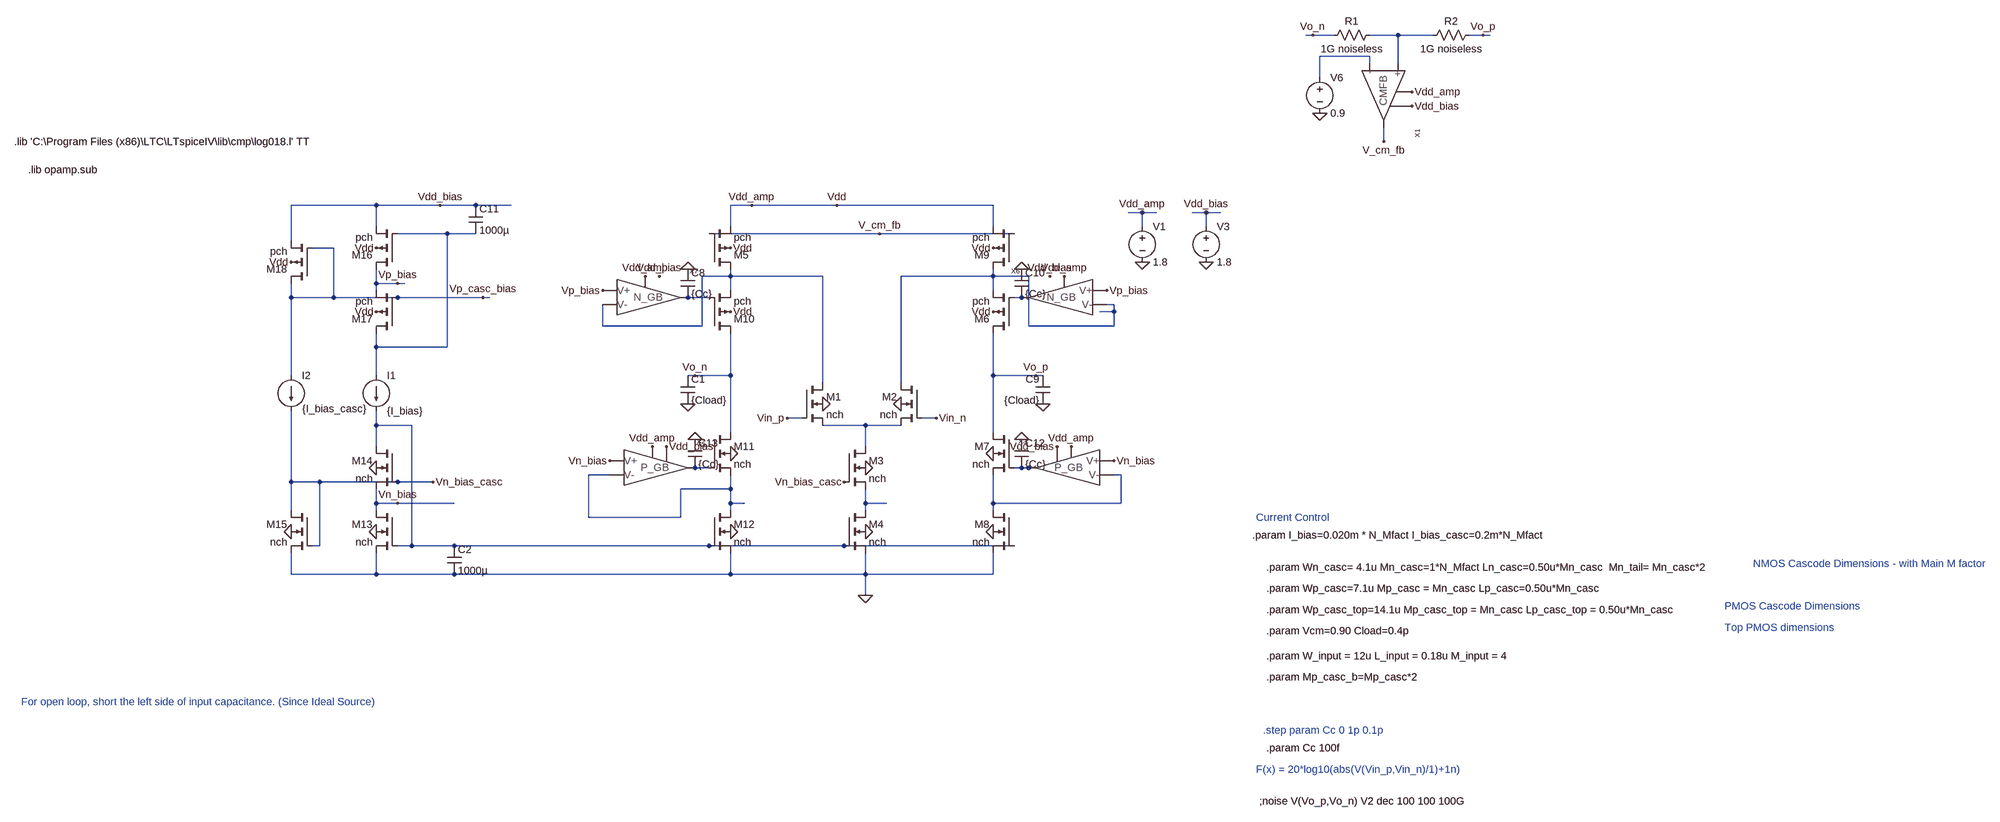
[diagram p0: schematic Discrete_Amplifier_1X Test_platform.asc]
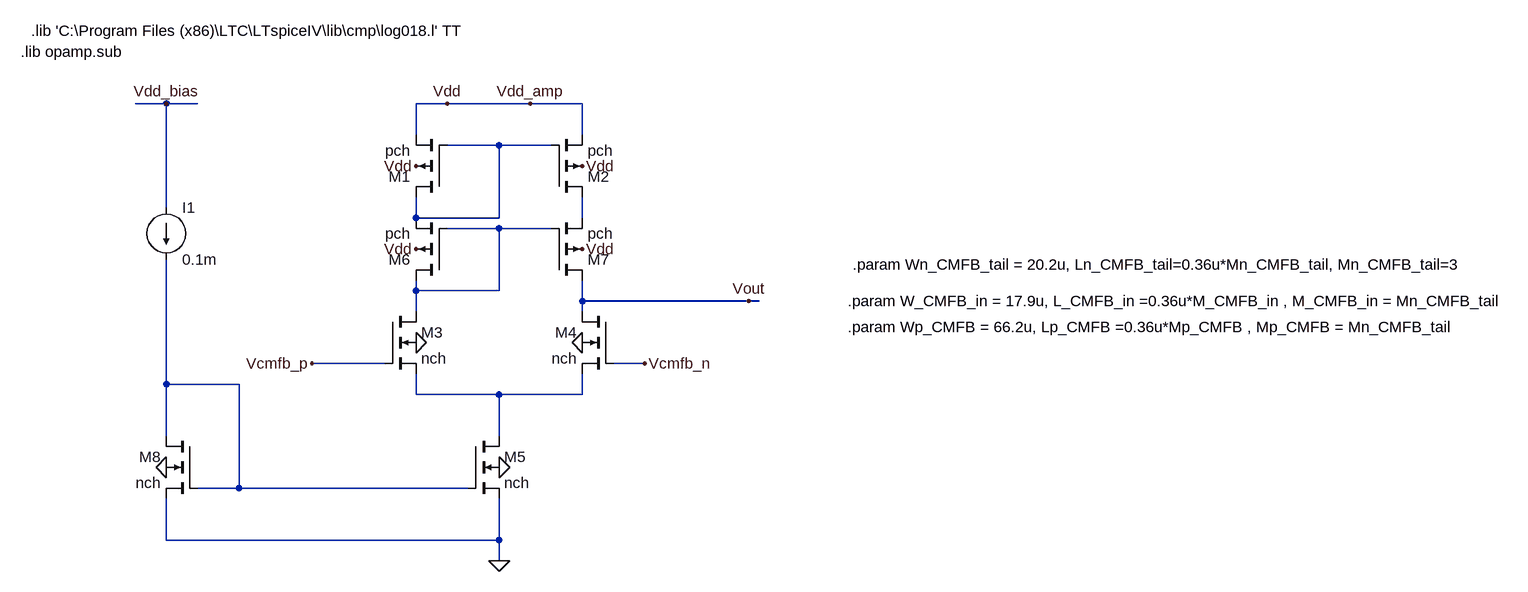
[diagram p1: sub-circuit cmfb_amplifier_comp_model.asc]
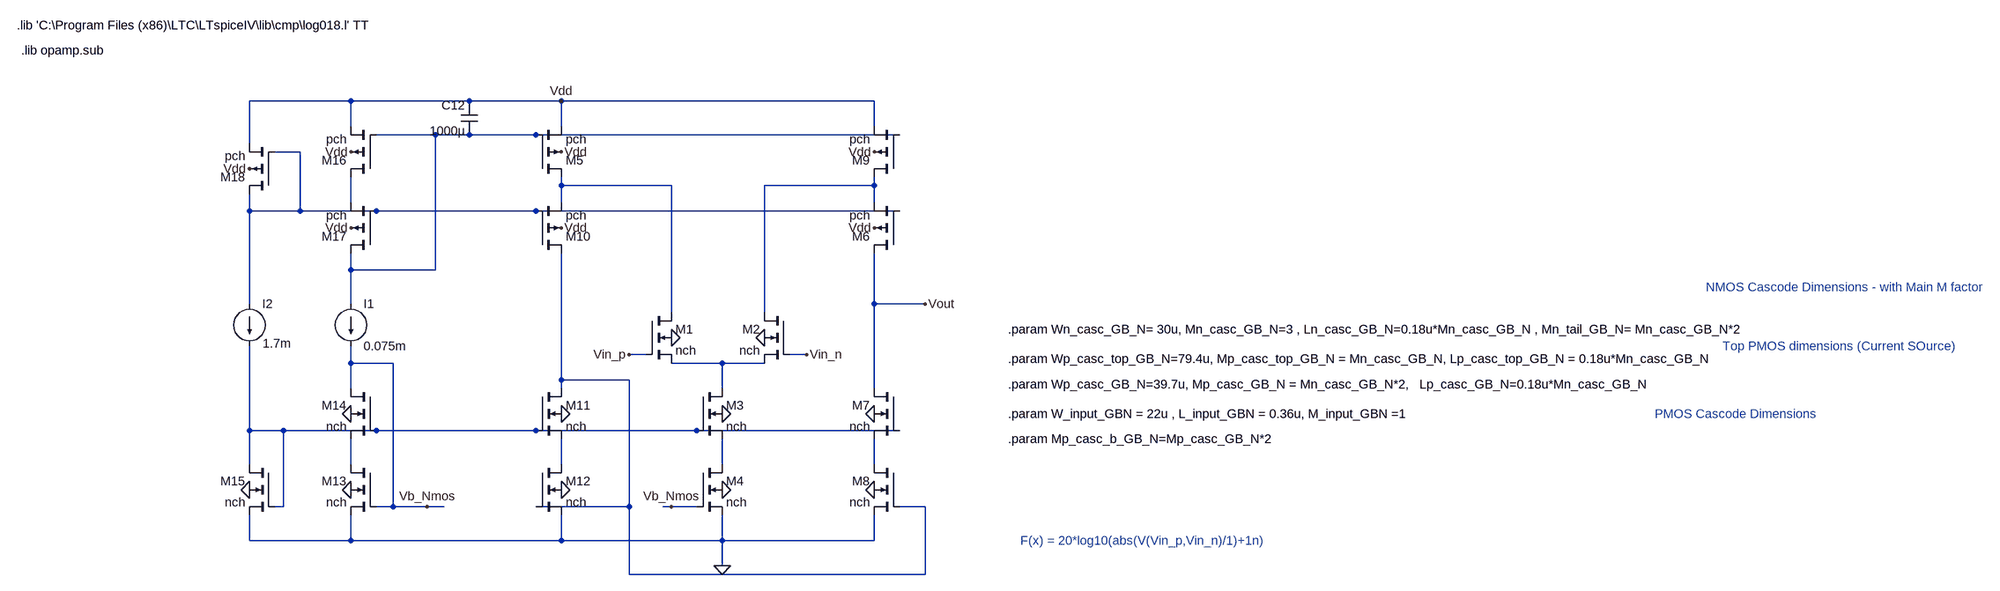
[diagram p2: sub-circuit gb-nmos.asc]
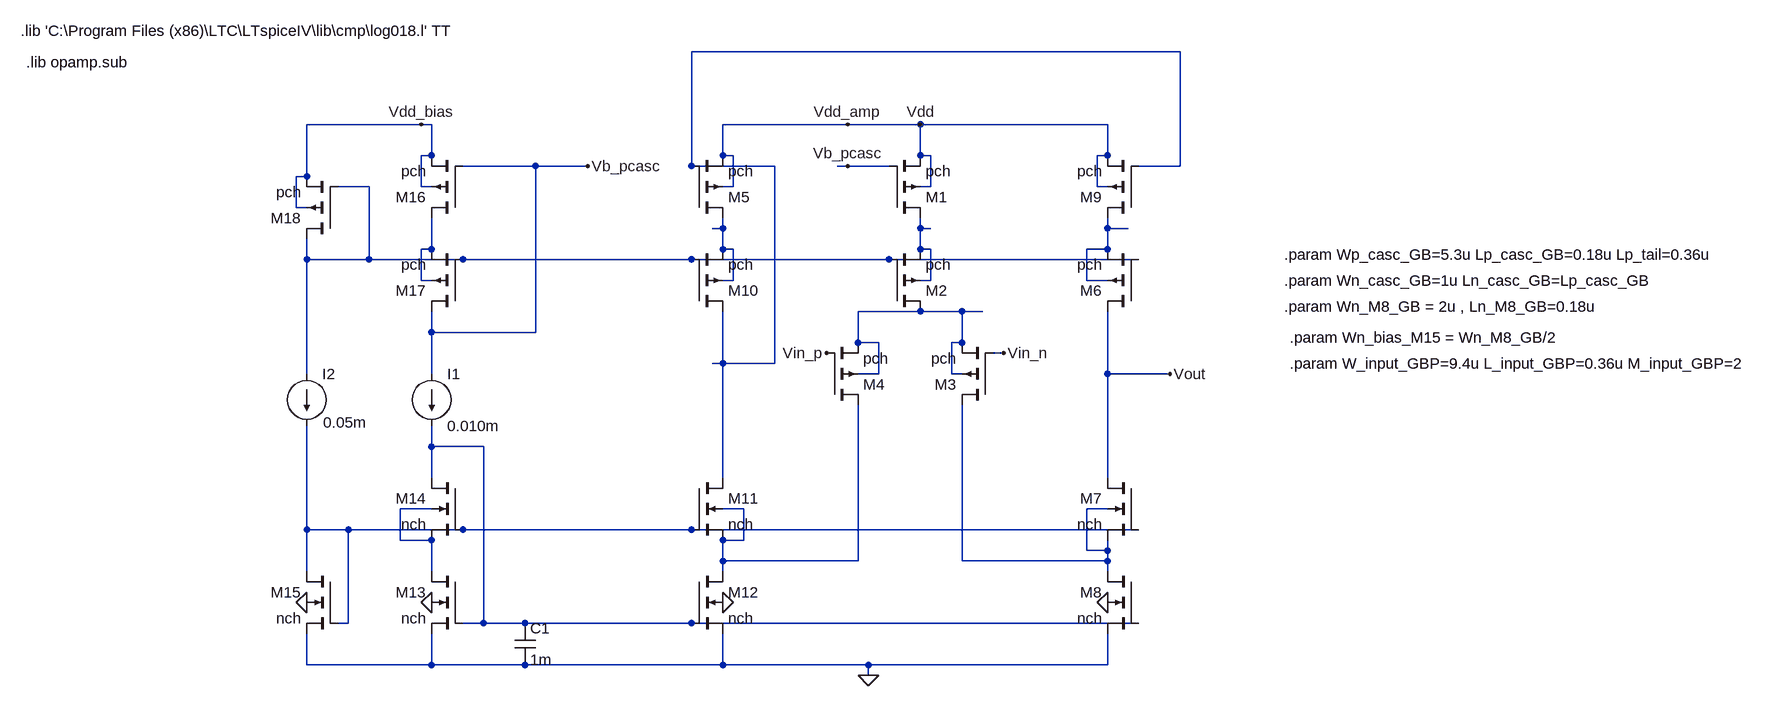
[diagram p3: sub-circuit gb-pmos.asc]
Discrete_Amplifier_1X Test_platform.asc, the LTspice schematic file:
Version 4
SHEET 1 5520 2052
WIRE 2368 -1264 2352 -1264
WIRE 2416 -1264 2368 -1264
WIRE 2560 -1264 2496 -1264
WIRE 2640 -1264 2560 -1264
WIRE 2752 -1264 2720 -1264
WIRE 2768 -1264 2752 -1264
WIRE 2496 -1216 2384 -1216
WIRE 2496 -1200 2496 -1216
WIRE 2560 -1200 2560 -1264
WIRE 2384 -1168 2384 -1216
WIRE 2528 -1024 2528 -1056
WIRE 208 -880 16 -880
WIRE 352 -880 208 -880
WIRE 432 -880 352 -880
WIRE 512 -880 432 -880
WIRE 1104 -880 1056 -880
WIRE 1296 -880 1104 -880
WIRE 1648 -880 1296 -880
WIRE 1984 -864 1952 -864
WIRE 2016 -864 1984 -864
WIRE 2128 -864 2096 -864
WIRE 2160 -864 2128 -864
WIRE 208 -832 208 -880
WIRE 1056 -832 1056 -880
WIRE 1648 -832 1648 -880
WIRE 1984 -832 1984 -864
WIRE 2128 -832 2128 -864
WIRE 368 -816 256 -816
WIRE 432 -816 368 -816
WIRE 1392 -816 1008 -816
WIRE 1696 -816 1392 -816
WIRE 16 -800 16 -880
WIRE 112 -784 64 -784
WIRE 1056 -720 1056 -736
WIRE 1056 -720 992 -720
WIRE 1264 -720 1056 -720
WIRE 1648 -720 1648 -736
WIRE 1648 -720 1440 -720
WIRE 1728 -720 1648 -720
WIRE 208 -704 208 -736
WIRE 256 -704 208 -704
WIRE 272 -704 256 -704
WIRE 208 -688 208 -704
WIRE 1056 -688 1056 -720
WIRE 1648 -688 1648 -720
WIRE 16 -672 16 -704
WIRE 112 -672 112 -784
WIRE 112 -672 16 -672
WIRE 256 -672 112 -672
WIRE 448 -672 256 -672
WIRE 464 -672 448 -672
WIRE 1008 -672 960 -672
WIRE 1712 -672 1696 -672
WIRE 1920 -656 1904 -656
WIRE 1920 -640 1920 -656
WIRE 1920 -640 1888 -640
WIRE 768 -608 768 -656
WIRE 992 -608 992 -720
WIRE 992 -608 768 -608
WIRE 1728 -608 1728 -720
WIRE 1920 -608 1920 -640
WIRE 1920 -608 1728 -608
WIRE 208 -560 208 -592
WIRE 368 -560 368 -816
WIRE 368 -560 208 -560
WIRE 16 -496 16 -672
WIRE 208 -496 208 -560
WIRE 976 -496 960 -496
WIRE 1056 -496 1056 -592
WIRE 1056 -496 976 -496
WIRE 1648 -496 1648 -592
WIRE 1744 -496 1648 -496
WIRE 1760 -496 1744 -496
WIRE 1264 -480 1264 -720
WIRE 1440 -480 1440 -720
WIRE 1216 -400 1184 -400
WIRE 1520 -400 1488 -400
WIRE 208 -384 208 -416
WIRE 288 -384 208 -384
WIRE 1360 -384 1264 -384
WIRE 1440 -384 1360 -384
WIRE 1056 -368 1056 -496
WIRE 1648 -368 1648 -496
WIRE 208 -336 208 -384
WIRE 1360 -336 1360 -384
WIRE 976 -288 960 -288
WIRE 1008 -288 976 -288
WIRE 1712 -288 1696 -288
WIRE 1728 -288 1712 -288
WIRE 1744 -288 1728 -288
WIRE 784 -272 736 -272
WIRE 1936 -272 1920 -272
WIRE 16 -256 16 -416
WIRE 80 -256 16 -256
WIRE 256 -256 80 -256
WIRE 336 -256 256 -256
WIRE 1056 -240 1056 -272
WIRE 1056 -240 944 -240
WIRE 208 -208 208 -240
WIRE 256 -208 208 -208
WIRE 384 -208 256 -208
WIRE 1056 -208 1056 -240
WIRE 1088 -208 1056 -208
WIRE 1360 -208 1360 -240
WIRE 1408 -208 1360 -208
WIRE 1648 -208 1648 -272
WIRE 1936 -208 1936 -272
WIRE 1936 -208 1648 -208
WIRE 16 -192 16 -256
WIRE 208 -192 208 -208
WIRE 1056 -192 1056 -208
WIRE 1360 -192 1360 -208
WIRE 1648 -192 1648 -208
WIRE 736 -176 736 -272
WIRE 944 -176 944 -240
WIRE 944 -176 736 -176
WIRE 80 -112 80 -256
WIRE 80 -112 64 -112
WIRE 288 -112 288 -384
WIRE 288 -112 256 -112
WIRE 384 -112 288 -112
WIRE 1008 -112 384 -112
WIRE 1312 -112 1008 -112
WIRE 1696 -112 1312 -112
WIRE 16 -48 16 -96
WIRE 208 -48 208 -96
WIRE 208 -48 16 -48
WIRE 384 -48 208 -48
WIRE 1056 -48 1056 -96
WIRE 1056 -48 384 -48
WIRE 1360 -48 1360 -96
WIRE 1360 -48 1056 -48
WIRE 1648 -48 1648 -96
WIRE 1648 -48 1360 -48
WIRE 1360 0 1360 -48
FLAG 1264 -432 0
FLAG 1360 -288 0
FLAG 1360 -144 0
FLAG 1360 0 0
FLAG 1056 -320 0
FLAG 1056 -144 0
FLAG 1984 -752 0
FLAG 1984 -864 Vdd_amp
FLAG 1056 -640 Vdd
FLAG 1056 -784 Vdd
FLAG 208 -144 0
FLAG 16 -144 0
FLAG 208 -288 0
FLAG 208 -784 Vdd
FLAG 208 -640 Vdd
FLAG 16 -752 Vdd
FLAG 1440 -432 0
FLAG 1648 -320 0
FLAG 1648 -144 0
FLAG 352 -880 Vdd_bias
FLAG 1648 -640 Vdd
FLAG 1648 -784 Vdd
FLAG 1392 -816 V_cm_fb
FLAG 1184 -400 Vin_p
FLAG 1520 -400 Vin_n
FLAG 976 -496 Vo_n
FLAG 1744 -496 Vo_p
FLAG 2752 -1264 Vo_p
FLAG 2368 -1264 Vo_n
FLAG 960 -432 0
FLAG 256 -208 Vn_bias
FLAG 336 -256 Vn_bias_casc
FLAG 1312 -256 Vn_bias_casc
FLAG 256 -704 Vp_bias
FLAG 2528 -1024 V_cm_fb
FLAG 2128 -752 0
FLAG 2128 -864 Vdd_bias
FLAG 2592 -1104 Vdd_bias
FLAG 2592 -1136 Vdd_amp
FLAG 1104 -880 Vdd_amp
FLAG 2384 -1088 0
FLAG 1296 -880 Vdd
FLAG 1808 -720 Vdd_amp
FLAG 1776 -720 Vdd_bias
FLAG 1904 -688 Vp_bias
FLAG 448 -672 Vp_casc_bias
FLAG 768 -688 Vp_bias
FLAG 864 -720 Vdd_amp
FLAG 896 -720 Vdd_bias
FLAG 1760 -432 0
FLAG 912 -336 Vdd_bias
FLAG 880 -336 Vdd_amp
FLAG 1792 -336 Vdd_bias
FLAG 1824 -336 Vdd_amp
FLAG 1712 -352 0
FLAG 976 -352 0
FLAG 784 -304 Vn_bias
FLAG 1920 -304 Vn_bias
FLAG 960 -736 0
FLAG 1712 -736 0
DATAFLAG 1360 -384 "round($*10k)/10k"
DATAFLAG 1408 -208 "round($*10k)/10k"
DATAFLAG 1168 -720 "round($*100)/100"
DATAFLAG 1536 -720 "round($*100)/100"
DATAFLAG 1552 -880 "round($*1k)/1k"
DATAFLAG 1648 -560 "round($*1k)/1k"
DATAFLAG 1264 -608 "Id(M1)"
DATAFLAG 2544 -1264 ""
DATAFLAG 320 -816 "round($*100)/100"
DATAFLAG 320 -672 "round($*10k)/10k"
DATAFLAG 384 -112 "round($*10k)/10k"
DATAFLAG 1136 -832 "-Id(M5)"
DATAFLAG 1280 -208 "Id(M4)"
DATAFLAG 1280 -112 "round($*10k)/10k"
DATAFLAG 384 -208 "round($*10k)/10k"
DATAFLAG 208 -704 "round($*10k)/10k"
DATAFLAG 1440 -608 "Id(M1)"
DATAFLAG 1056 -560 "round($*1k)/1k"
DATAFLAG 1264 -816 ""
DATAFLAG 320 -256 "round($*10k)/10k"
DATAFLAG 1648 -208 "round($*10k)/10k"
DATAFLAG 1088 -208 "round($*10k)/10k"
DATAFLAG 992 -288 ""
SYMBOL nmos4 1216 -480 R0
SYMATTR InstName M1
SYMATTR Value nch
SYMATTR Value2 l={L_input} w={W_input} m={M_input}
SYMBOL nmos4 1312 -336 R0
SYMATTR InstName M3
SYMATTR Value nch
SYMATTR Value2 l={Ln_casc} w={Wn_casc} m={Mn_tail}
SYMBOL nmos4 1312 -192 R0
SYMATTR InstName M4
SYMATTR Value nch
SYMATTR Value2 l={Ln_casc} w={Wn_casc} m={Mn_tail}
SYMBOL pmos4 1008 -592 M180
SYMATTR InstName M10
SYMATTR Value pch
SYMATTR Value2 l={Lp_casc} w={Wp_casc} m={Mp_casc}
SYMBOL nmos4 1008 -368 R0
SYMATTR InstName M11
SYMATTR Value nch
SYMATTR Value2 l={Ln_casc} w={Wn_casc} m={Mn_casc}
SYMBOL nmos4 1008 -192 R0
SYMATTR InstName M12
SYMATTR Value nch
SYMATTR Value2 l={Ln_casc} w={Wn_casc} m={Mn_casc}
SYMBOL voltage 1984 -848 R0
WINDOW 123 0 0 Left 2
WINDOW 39 0 0 Left 2
SYMATTR InstName V1
SYMATTR Value 1.8
SYMBOL pmos4 1008 -736 M180
SYMATTR InstName M5
SYMATTR Value pch
SYMATTR Value2 l={Lp_casc_top} w={Wp_casc_top} m={Mp_casc_top}
SYMBOL res 2512 -1280 R90
WINDOW 0 0 56 VBottom 2
WINDOW 3 32 56 VTop 2
SYMATTR InstName R1
SYMATTR Value 1G noiseless
SYMBOL res 2736 -1280 R90
WINDOW 0 0 56 VBottom 2
WINDOW 3 32 56 VTop 2
SYMATTR InstName R2
SYMATTR Value 1G noiseless
SYMBOL nmos4 256 -192 M0
SYMATTR InstName M13
SYMATTR Value nch
SYMATTR Value2 l={Ln_casc} w={Wn_casc} m={Mn_tail}
SYMBOL current 208 -496 R0
WINDOW 123 0 0 Left 2
WINDOW 39 0 0 Left 2
SYMATTR InstName I1
SYMATTR Value {I_bias}
SYMBOL nmos4 256 -336 M0
SYMATTR InstName M14
SYMATTR Value nch
SYMATTR Value2 l={Ln_casc} w={Wn_casc} m={Mn_tail}
SYMBOL current 16 -496 R0
WINDOW 123 0 0 Left 2
WINDOW 39 0 0 Left 2
WINDOW 3 25 75 Left 2
SYMATTR Value {I_bias_casc}
SYMATTR InstName I2
SYMBOL nmos4 64 -192 M0
SYMATTR InstName M15
SYMATTR Value nch
SYMATTR Value2 l={Ln_casc} w={Wn_casc} m={Mn_tail}
SYMBOL pmos4 256 -736 R180
SYMATTR InstName M16
SYMATTR Value pch
SYMATTR Value2 l={Lp_casc_top} w={Wp_casc_top} m={Mp_casc_top}
SYMBOL pmos4 256 -592 R180
SYMATTR InstName M17
SYMATTR Value pch
SYMATTR Value2 l={Lp_casc} w={Wp_casc} m={Mp_casc}
SYMBOL pmos4 64 -704 R180
SYMATTR InstName M18
SYMATTR Value pch
SYMATTR Value2 l={Lp_casc} w={Wp_casc} m={Mp_casc_b}
SYMBOL nmos4 1488 -480 M0
SYMATTR InstName M2
SYMATTR Value nch
SYMATTR Value2 l={L_input} w={W_input} m={M_input}
SYMBOL pmos4 1696 -592 R180
SYMATTR InstName M6
SYMATTR Value pch
SYMATTR Value2 l={Lp_casc} w={Wp_casc} m={Mp_casc}
SYMBOL nmos4 1696 -368 M0
SYMATTR InstName M7
SYMATTR Value nch
SYMATTR Value2 l={Ln_casc} w={Wn_Casc} m={Mn_casc}
SYMBOL nmos4 1696 -192 M0
SYMATTR InstName M8
SYMATTR Value nch
SYMATTR Value2 l={Ln_casc} w={Wn_Casc} m={Mn_casc}
SYMBOL pmos4 1696 -736 R180
SYMATTR InstName M9
SYMATTR Value pch
SYMATTR Value2 l={Lp_casc_top} w={Wp_casc_top} m={Mp_casc_top}
SYMBOL cap 368 -112 R0
SYMATTR InstName C2
SYMATTR Value 1000µ
SYMBOL cap 944 -496 R0
SYMATTR InstName C1
SYMATTR Value {Cload}
SYMBOL cap 1776 -496 M0
SYMATTR InstName C9
SYMATTR Value {Cload}
SYMBOL cap 416 -880 R0
SYMATTR InstName C11
SYMATTR Value 1000µ
SYMBOL CMFB_Amplifier_comp_model 2528 -1136 R90
SYMATTR InstName X1
SYMBOL voltage 2128 -848 R0
WINDOW 123 0 0 Left 2
WINDOW 39 0 0 Left 2
SYMATTR InstName V3
SYMATTR Value 1.8
SYMBOL voltage 2384 -1184 R0
WINDOW 123 0 0 Left 2
WINDOW 39 0 0 Left 2
SYMATTR InstName V6
SYMATTR Value 0.9
SYMBOL GB-NMOS 1808 -672 M0
SYMATTR InstName X6
SYMBOL GB-NMOS 864 -672 R0
SYMATTR InstName X7
SYMBOL GB-PMOS 880 -288 R0
SYMATTR InstName X2
SYMBOL GB-PMOS 1824 -288 M0
SYMATTR InstName X3
SYMBOL cap 1696 -352 R0
SYMATTR InstName C12
SYMATTR Value {Cc}
SYMBOL cap 960 -352 R0
SYMATTR InstName C13
SYMATTR Value {Cc}
SYMBOL cap 944 -736 R0
SYMATTR InstName C8
SYMATTR Value {Cc}
SYMBOL cap 1696 -736 R0
SYMATTR InstName C10
SYMATTR Value {Cc}
TEXT -608 -1024 Left 2 !.lib 'C:\\Program Files (x86)\\LTC\\LTspiceIV\\lib\\cmp\\log018.l' TT
TEXT -576 -960 Left 2 !.lib opamp.sub
TEXT 2264 -64 Left 2 !.param Wn_casc= 4.1u Mn_casc=1*N_Mfact Ln_casc=0.50u*Mn_casc  Mn_tail= Mn_casc*2
TEXT 2264 -16 Left 2 !.param Wp_casc=7.1u Mp_casc = Mn_casc Lp_casc=0.50u*Mn_casc
TEXT 2264 32 Left 2 !.param Wp_casc_top=14.1u Mp_casc_top = Mn_casc Lp_casc_top = 0.50u*Mn_casc
TEXT 2264 80 Left 2 !.param Vcm=0.90 Cload=0.4p
TEXT 2240 392 Left 2 ;F(x) = 20*log10(abs(V(Vin_p,Vin_n)/1)+1n)
TEXT 3296 72 Left 2 ;Top PMOS dimensions
TEXT 3296 24 Left 2 ;PMOS Cascode Dimensions
TEXT 3360 -72 Left 2 ;NMOS Cascode Dimensions - with Main M factor
TEXT 2264 184 Left 2 !.param Mp_casc_b=Mp_casc*2
TEXT -592 240 Left 2 ;For open loop, short the left side of input capacitance. (Since Ideal Source)
TEXT 2264 136 Left 2 !.param W_input = 12u L_input = 0.18u M_input = 4
TEXT 2248 464 Left 2 !;noise V(Vo_p,Vo_n) V2 dec 100 100 100G
TEXT 2240 -176 Left 2 ;Current Control
TEXT 2232 -136 Left 2 !.param I_bias=0.020m * N_Mfact I_bias_casc=0.2m*N_Mfact
TEXT 2256 304 Left 2 ;.step param Cc 0 1p 0.1p
TEXT 2264 344 Left 2 !.param Cc 100f

cmfb_amplifier_comp_model.asc, the sub-circuit schematic file:
Version 4
SHEET 1 2296 852
WIRE -544 -272 -592 -272
WIRE -496 -272 -544 -272
WIRE -112 -272 -160 -272
WIRE 16 -272 -112 -272
WIRE 96 -272 16 -272
WIRE -160 -224 -160 -272
WIRE 96 -224 96 -272
WIRE -32 -208 -112 -208
WIRE 48 -208 -32 -208
WIRE -544 -112 -544 -272
WIRE -160 -96 -160 -128
WIRE -32 -96 -32 -208
WIRE -32 -96 -160 -96
WIRE 96 -96 96 -128
WIRE -32 -80 -112 -80
WIRE 48 -80 -32 -80
WIRE -160 16 -160 0
WIRE -32 16 -32 -80
WIRE -32 16 -160 16
WIRE 96 32 96 0
WIRE 352 32 96 32
WIRE 368 32 352 32
WIRE -160 48 -160 16
WIRE 96 48 96 32
WIRE -208 128 -320 128
WIRE 192 128 144 128
WIRE -544 160 -544 -32
WIRE -432 160 -544 160
WIRE -160 176 -160 144
WIRE -32 176 -160 176
WIRE 96 176 96 144
WIRE 96 176 -32 176
WIRE -544 240 -544 160
WIRE -32 240 -32 176
WIRE -432 320 -432 160
WIRE -432 320 -496 320
WIRE -80 320 -432 320
WIRE -544 400 -544 336
WIRE -32 400 -32 336
WIRE -32 400 -544 400
WIRE -32 432 -32 400
FLAG -160 -176 Vdd
FLAG 96 -176 Vdd
FLAG -160 96 0
FLAG 96 96 0
FLAG -32 432 0
FLAG -32 288 0
FLAG -544 288 0
FLAG 16 -272 Vdd_amp
FLAG 352 32 Vout
FLAG -320 128 Vcmfb_p
FLAG 192 128 Vcmfb_n
FLAG -160 -48 Vdd
FLAG 96 -48 Vdd
FLAG -544 -272 Vdd_bias
FLAG -112 -272 Vdd
DATAFLAG -32 176 "round($*1000)/1000"
DATAFLAG 16 224 "round(Id(M23)*100000000)/100000000"
DATAFLAG -320 320 ""
DATAFLAG 176 16 "round($*1000)/1000"
DATAFLAG -32 -208 "round($*1000)/1000"
DATAFLAG 144 -96 "round(-Id(x6:x5:M2)*100000000)/100000000"
DATAFLAG -96 224 "round(Id(x6:x5:M5)*100000000)/100000000"
DATAFLAG -224 -112 "round(-Id(x6:x5:M1)*100000000)/100000000"
DATAFLAG -32 -80 "round($*1000)/1000"
SYMBOL pmos4 -112 -128 R180
SYMATTR InstName M1
SYMATTR Value pch
SYMATTR Value2 l={Lp_CMFB} w={Wp_CMFB} m={Mp_CMFB}
SYMBOL pmos4 48 -128 M180
SYMATTR InstName M2
SYMATTR Value pch
SYMATTR Value2 l={Lp_CMFB} w={Wp_CMFB} m={Mp_CMFB}
SYMBOL nmos4 -208 48 R0
SYMATTR InstName M3
SYMATTR Value nch
SYMATTR Value2 l={L_CMFB_in} w={W_CMFB_in} m={M_CMFB_in}
SYMBOL nmos4 144 48 M0
SYMATTR InstName M4
SYMATTR Value nch
SYMATTR Value2 l={L_CMFB_in} w={W_CMFB_in} m={M_CMFB_in}
SYMBOL nmos4 -80 240 R0
SYMATTR InstName M5
SYMATTR Value nch
SYMATTR Value2 l={Ln_CMFB_tail} w={Wn_CMFB_tail} m={Mn_CMFB_tail}
SYMBOL current -544 -112 R0
WINDOW 123 0 0 Left 2
WINDOW 39 0 0 Left 2
SYMATTR InstName I1
SYMATTR Value 0.1m
SYMBOL nmos4 -496 240 M0
SYMATTR InstName M8
SYMATTR Value nch
SYMATTR Value2 l={Ln_CMFB_tail} w={Wn_CMFB_tail} m={Mn_CMFB_tail}
SYMBOL pmos4 -112 0 R180
SYMATTR InstName M6
SYMATTR Value pch
SYMATTR Value2 l={Lp_CMFB} w={Wp_CMFB} m={Mp_CMFB}
SYMBOL pmos4 48 0 M180
SYMATTR InstName M7
SYMATTR Value pch
SYMATTR Value2 l={Lp_CMFB} w={Wp_CMFB} m={Mp_CMFB}
TEXT -752 -384 Left 2 !.lib 'C:\\Program Files (x86)\\LTC\\LTspiceIV\\lib\\cmp\\log018.l' TT
TEXT -768 -352 Left 2 !.lib opamp.sub
TEXT 512 -24 Left 2 !.param Wn_CMFB_tail = 20.2u, Ln_CMFB_tail=0.36u*Mn_CMFB_tail, Mn_CMFB_tail=3
TEXT 504 72 Left 2 !.param Wp_CMFB = 66.2u, Lp_CMFB =0.36u*Mp_CMFB , Mp_CMFB = Mn_CMFB_tail
TEXT 504 32 Left 2 !.param W_CMFB_in = 17.9u, L_CMFB_in =0.36u*M_CMFB_in , M_CMFB_in = Mn_CMFB_tail

gb-nmos.asc, the sub-circuit schematic file:
Version 4
SHEET 1 3836 784
WIRE 432 -880 240 -880
WIRE 656 -880 432 -880
WIRE 880 -880 656 -880
WIRE 1376 -880 880 -880
WIRE 1472 -880 1376 -880
WIRE 880 -848 880 -880
WIRE 432 -832 432 -880
WIRE 880 -832 880 -848
WIRE 1472 -832 1472 -880
WIRE 592 -816 480 -816
WIRE 656 -816 592 -816
WIRE 832 -816 656 -816
WIRE 1520 -816 832 -816
WIRE 240 -800 240 -880
WIRE 336 -784 288 -784
WIRE 880 -720 880 -736
WIRE 1088 -720 880 -720
WIRE 1472 -720 1472 -736
WIRE 1472 -720 1264 -720
WIRE 432 -688 432 -736
WIRE 880 -688 880 -720
WIRE 1472 -688 1472 -720
WIRE 240 -672 240 -704
WIRE 336 -672 336 -784
WIRE 336 -672 240 -672
WIRE 480 -672 336 -672
WIRE 704 -672 480 -672
WIRE 832 -672 704 -672
WIRE 1520 -672 832 -672
WIRE 432 -560 432 -592
WIRE 592 -560 592 -816
WIRE 592 -560 432 -560
WIRE 1472 -560 1472 -592
WIRE 240 -496 240 -672
WIRE 432 -496 432 -560
WIRE 1472 -496 1472 -560
WIRE 1568 -496 1472 -496
WIRE 1088 -480 1088 -720
WIRE 1264 -480 1264 -720
WIRE 880 -464 880 -592
WIRE 1040 -400 1008 -400
WIRE 1344 -400 1312 -400
WIRE 432 -384 432 -416
WIRE 512 -384 432 -384
WIRE 1184 -384 1088 -384
WIRE 1264 -384 1184 -384
WIRE 880 -352 880 -464
WIRE 1008 -352 880 -352
WIRE 432 -336 432 -384
WIRE 880 -336 880 -352
WIRE 1184 -336 1184 -384
WIRE 1472 -336 1472 -496
WIRE 240 -256 240 -416
WIRE 304 -256 240 -256
WIRE 480 -256 304 -256
WIRE 832 -256 480 -256
WIRE 1136 -256 832 -256
WIRE 1360 -256 1136 -256
WIRE 1520 -256 1360 -256
WIRE 240 -192 240 -256
WIRE 432 -192 432 -240
WIRE 880 -192 880 -240
WIRE 1184 -192 1184 -240
WIRE 1472 -192 1472 -240
WIRE 304 -112 304 -256
WIRE 304 -112 288 -112
WIRE 512 -112 512 -384
WIRE 512 -112 480 -112
WIRE 576 -112 512 -112
WIRE 608 -112 576 -112
WIRE 1008 -112 1008 -352
WIRE 1008 -112 832 -112
WIRE 1088 -112 1072 -112
WIRE 1136 -112 1088 -112
WIRE 1568 -112 1520 -112
WIRE 240 -48 240 -96
WIRE 432 -48 432 -96
WIRE 432 -48 240 -48
WIRE 880 -48 880 -96
WIRE 880 -48 432 -48
WIRE 1184 -48 1184 -96
WIRE 1184 -48 880 -48
WIRE 1472 -48 1472 -96
WIRE 1472 -48 1184 -48
WIRE 1184 0 1184 -48
WIRE 1008 16 1008 -112
WIRE 1456 16 1008 16
WIRE 1568 16 1568 -112
WIRE 1568 16 1456 16
FLAG 1088 -432 0
FLAG 1184 -288 0
FLAG 1184 -144 0
FLAG 1184 0 0
FLAG 880 -288 0
FLAG 880 -144 0
FLAG 880 -880 Vdd
FLAG 880 -640 Vdd
FLAG 880 -784 Vdd
FLAG 432 -144 0
FLAG 240 -144 0
FLAG 432 -288 0
FLAG 432 -784 Vdd
FLAG 432 -640 Vdd
FLAG 240 -752 Vdd
FLAG 1264 -432 0
FLAG 1472 -288 0
FLAG 1472 -144 0
FLAG 1472 -640 Vdd
FLAG 1472 -784 Vdd
FLAG 1008 -400 Vin_p
FLAG 1344 -400 Vin_n
FLAG 576 -112 Vb_Nmos
FLAG 1088 -112 Vb_Nmos
FLAG 1568 -496 Vout
DATAFLAG 1184 -384 "round($*10k)/10k"
DATAFLAG 1376 -880 "round($*1k)/1k"
DATAFLAG 1472 -560 "round($*1k)/1k"
DATAFLAG 704 -672 ""
DATAFLAG 1360 -256 ""
DATAFLAG 1456 16 ""
DATAFLAG 880 -848 "-Id(x1:M5)"
DATAFLAG 880 -464 "-Id(x1:M10)"
DATAFLAG 1168 -608 "Id(x2:M1)"
DATAFLAG 1168 -560 "Id(x1:M1)"
SYMBOL nmos4 1040 -480 R0
SYMATTR InstName M1
SYMATTR Value nch
SYMATTR Value2 l={L_input_GBN} w={W_input_GBN} m={M_input_GBN}
SYMBOL nmos4 1136 -336 R0
SYMATTR InstName M3
SYMATTR Value nch
SYMATTR Value2 l={Ln_casc_GB_N} w={Wn_casc_GB_N} m={Mn_tail_GB_N}
SYMBOL nmos4 1136 -192 R0
SYMATTR InstName M4
SYMATTR Value nch
SYMATTR Value2 l={Ln_casc_GB_N} w={Wn_casc_GB_N} m={Mn_tail_GB_N}
SYMBOL pmos4 832 -592 M180
SYMATTR InstName M10
SYMATTR Value pch
SYMATTR Value2 l={Lp_casc_GB_N} w={Wp_casc_GB_N} m={Mp_casc_GB_N}
SYMBOL nmos4 832 -336 R0
SYMATTR InstName M11
SYMATTR Value nch
SYMATTR Value2 l={Ln_casc_GB_N} w={Wn_casc_GB_N} m={Mn_casc_GB_N}
SYMBOL nmos4 832 -192 R0
SYMATTR InstName M12
SYMATTR Value nch
SYMATTR Value2 l={Ln_casc_GB_N} w={Wn_casc_GB_N} m={Mn_casc_GB_N}
SYMBOL pmos4 832 -736 M180
SYMATTR InstName M5
SYMATTR Value pch
SYMATTR Value2 l={Lp_casc_top_GB_N} w={Wp_casc_top_GB_N} m={Mp_casc_top_GB_N}
SYMBOL nmos4 480 -192 M0
SYMATTR InstName M13
SYMATTR Value nch
SYMATTR Value2 l={Ln_casc_GB_N} w={Wn_casc_GB_N} m={Mn_tail_GB_N}
SYMBOL current 432 -496 R0
WINDOW 123 0 0 Left 2
WINDOW 39 0 0 Left 2
SYMATTR InstName I1
SYMATTR Value 0.075m
SYMBOL nmos4 480 -336 M0
SYMATTR InstName M14
SYMATTR Value nch
SYMATTR Value2 l={Ln_casc_GB_N} w={Wn_casc_GB_N} m={Mn_tail_GB_N}
SYMBOL current 240 -496 R0
WINDOW 123 0 0 Left 2
WINDOW 39 0 0 Left 2
WINDOW 3 25 75 Left 2
SYMATTR Value 1.7m
SYMATTR InstName I2
SYMBOL nmos4 288 -192 M0
SYMATTR InstName M15
SYMATTR Value nch
SYMATTR Value2 l={Ln_casc_GB_N} w={Wn_casc_GB_N} m={Mn_tail_GB_N}
SYMBOL pmos4 480 -736 R180
SYMATTR InstName M16
SYMATTR Value pch
SYMATTR Value2 l={Lp_casc_top_GB_N} w={Wp_casc_top_GB_N} m={Mp_casc_top_GB_N}
SYMBOL pmos4 480 -592 R180
SYMATTR InstName M17
SYMATTR Value pch
SYMATTR Value2 l={Lp_casc_GB_N} w={Wp_casc_GB_N} m={Mp_casc_GB_N}
SYMBOL pmos4 288 -704 R180
SYMATTR InstName M18
SYMATTR Value pch
SYMATTR Value2 l={Lp_casc_GB_N} w={Wp_casc_GB_N} m={Mp_casc_b_GB_N}
SYMBOL nmos4 1312 -480 M0
SYMATTR InstName M2
SYMATTR Value nch
SYMATTR Value2 l={L_input_GBN} w={W_input_GBN} m={M_input_GBN}
SYMBOL pmos4 1520 -592 R180
SYMATTR InstName M6
SYMATTR Value pch
SYMATTR Value2 l={Lp_casc_GB_N} w={Wp_casc_GB_N} m={Mp_casc_GB_N}
SYMBOL nmos4 1520 -336 M0
SYMATTR InstName M7
SYMATTR Value nch
SYMATTR Value2 l={Ln_casc_GB_N} w={Wn_Casc_GB_N} m={Mn_casc_GB_N}
SYMBOL nmos4 1520 -192 M0
SYMATTR InstName M8
SYMATTR Value nch
SYMATTR Value2 l={Ln_casc_GB_N} w={Wn_Casc_GB_N} m={Mn_casc_GB_N}
SYMBOL pmos4 1520 -736 R180
SYMATTR InstName M9
SYMATTR Value pch
SYMATTR Value2 l={Lp_casc_top_GB_N} w={Wp_casc_top_GB_N} m={Mp_casc_top_GB_N}
SYMBOL cap 672 -816 R180
WINDOW 0 24 56 Left 2
WINDOW 3 24 8 Left 2
SYMATTR InstName C12
SYMATTR Value 1000µ
TEXT -200 -1024 Left 2 !.lib 'C:\\Program Files (x86)\\LTC\\LTspiceIV\\lib\\cmp\\log018.l' TT
TEXT -192 -976 Left 2 !.lib opamp.sub
TEXT 1888 -448 Left 2 !.param Wn_casc_GB_N= 30u, Mn_casc_GB_N=3 , Ln_casc_GB_N=0.18u*Mn_casc_GB_N , Mn_tail_GB_N= Mn_casc_GB_N*2
TEXT 1888 -344 Left 2 !.param Wp_casc_GB_N=39.7u, Mp_casc_GB_N = Mn_casc_GB_N*2,   Lp_casc_GB_N=0.18u*Mn_casc_GB_N
TEXT 1888 -392 Left 2 !.param Wp_casc_top_GB_N=79.4u, Mp_casc_top_GB_N = Mn_casc_GB_N, Lp_casc_top_GB_N = 0.18u*Mn_casc_GB_N
TEXT 1912 -48 Left 2 ;F(x) = 20*log10(abs(V(Vin_p,Vin_n)/1)+1n)
TEXT 3240 -416 Left 2 ;Top PMOS dimensions (Current SOurce)
TEXT 3112 -288 Left 2 ;PMOS Cascode Dimensions
TEXT 3208 -528 Left 2 ;NMOS Cascode Dimensions - with Main M factor
TEXT 1888 -240 Left 2 !.param Mp_casc_b_GB_N=Mp_casc_GB_N*2
TEXT 1888 -288 Left 2 !.param W_input_GBN = 22u , L_input_GBN = 0.36u, M_input_GBN =1

gb-pmos.asc, the sub-circuit schematic file:
Version 4
SHEET 1 3836 784
WIRE 1584 -992 832 -992
WIRE 416 -880 240 -880
WIRE 432 -880 416 -880
WIRE 1072 -880 880 -880
WIRE 1184 -880 1072 -880
WIRE 1472 -880 1184 -880
WIRE 432 -832 432 -880
WIRE 432 -832 416 -832
WIRE 880 -832 880 -880
WIRE 896 -832 880 -832
WIRE 1184 -832 1184 -880
WIRE 1200 -832 1184 -832
WIRE 1472 -832 1472 -880
WIRE 1472 -832 1456 -832
WIRE 592 -816 480 -816
WIRE 672 -816 592 -816
WIRE 832 -816 832 -992
WIRE 960 -816 832 -816
WIRE 1072 -816 1056 -816
WIRE 1136 -816 1072 -816
WIRE 1584 -816 1584 -992
WIRE 1584 -816 1520 -816
WIRE 240 -800 240 -880
WIRE 240 -800 224 -800
WIRE 336 -784 288 -784
WIRE 416 -784 416 -832
WIRE 432 -784 416 -784
WIRE 896 -784 896 -832
WIRE 896 -784 880 -784
WIRE 1200 -784 1200 -832
WIRE 1200 -784 1184 -784
WIRE 1456 -784 1456 -832
WIRE 1472 -784 1456 -784
WIRE 224 -752 224 -800
WIRE 240 -752 224 -752
WIRE 880 -720 880 -736
WIRE 880 -720 864 -720
WIRE 1184 -720 1184 -736
WIRE 1200 -720 1184 -720
WIRE 1472 -720 1472 -736
WIRE 1504 -720 1472 -720
WIRE 432 -688 432 -736
WIRE 432 -688 416 -688
WIRE 880 -688 880 -720
WIRE 896 -688 880 -688
WIRE 1184 -688 1184 -720
WIRE 1200 -688 1184 -688
WIRE 1472 -688 1472 -720
WIRE 1472 -688 1440 -688
WIRE 240 -672 240 -704
WIRE 336 -672 336 -784
WIRE 336 -672 240 -672
WIRE 480 -672 336 -672
WIRE 832 -672 480 -672
WIRE 1136 -672 832 -672
WIRE 1520 -672 1136 -672
WIRE 416 -640 416 -688
WIRE 432 -640 416 -640
WIRE 896 -640 896 -688
WIRE 896 -640 880 -640
WIRE 1200 -640 1200 -688
WIRE 1200 -640 1184 -640
WIRE 1440 -640 1440 -688
WIRE 1472 -640 1440 -640
WIRE 1184 -592 1088 -592
WIRE 1248 -592 1184 -592
WIRE 1280 -592 1248 -592
WIRE 432 -560 432 -592
WIRE 592 -560 592 -816
WIRE 592 -560 432 -560
WIRE 1088 -544 1088 -592
WIRE 1120 -544 1088 -544
WIRE 1248 -544 1248 -592
WIRE 1248 -544 1232 -544
WIRE 1312 -528 1296 -528
WIRE 880 -512 880 -592
WIRE 880 -512 864 -512
WIRE 960 -512 960 -816
WIRE 960 -512 880 -512
WIRE 240 -496 240 -672
WIRE 432 -496 432 -560
WIRE 1120 -496 1120 -544
WIRE 1120 -496 1088 -496
WIRE 1232 -496 1232 -544
WIRE 1248 -496 1232 -496
WIRE 1472 -496 1472 -592
WIRE 1568 -496 1472 -496
WIRE 880 -336 880 -512
WIRE 1088 -208 1088 -448
WIRE 1248 -208 1248 -448
WIRE 1472 -336 1472 -496
WIRE 432 -384 432 -416
WIRE 512 -384 432 -384
WIRE 432 -336 432 -384
WIRE 432 -288 384 -288
WIRE 912 -288 880 -288
WIRE 1472 -288 1440 -288
WIRE 240 -256 240 -416
WIRE 304 -256 240 -256
WIRE 480 -256 304 -256
WIRE 832 -256 480 -256
WIRE 1520 -256 832 -256
WIRE 384 -240 384 -288
WIRE 432 -240 384 -240
WIRE 912 -240 912 -288
WIRE 912 -240 880 -240
WIRE 1440 -224 1440 -288
WIRE 1472 -224 1472 -240
WIRE 1472 -224 1440 -224
WIRE 880 -208 880 -240
WIRE 1088 -208 880 -208
WIRE 1472 -208 1248 -208
WIRE 1472 -208 1472 -224
WIRE 240 -192 240 -256
WIRE 432 -192 432 -240
WIRE 880 -192 880 -208
WIRE 1472 -192 1472 -208
WIRE 304 -112 304 -256
WIRE 304 -112 288 -112
WIRE 512 -112 512 -384
WIRE 512 -112 480 -112
WIRE 576 -112 512 -112
WIRE 832 -112 576 -112
WIRE 1520 -112 832 -112
WIRE 240 -48 240 -96
WIRE 432 -48 432 -96
WIRE 432 -48 240 -48
WIRE 576 -48 432 -48
WIRE 880 -48 880 -96
WIRE 880 -48 576 -48
WIRE 1104 -48 880 -48
WIRE 1472 -48 1472 -96
WIRE 1472 -48 1104 -48
WIRE 1104 -32 1104 -48
FLAG 880 -144 0
FLAG 1072 -880 Vdd_amp
FLAG 432 -144 0
FLAG 240 -144 0
FLAG 1472 -144 0
FLAG 1104 -32 0
FLAG 1568 -496 Vout
FLAG 1040 -528 Vin_p
FLAG 1312 -528 Vin_n
FLAG 672 -816 Vb_pcasc
FLAG 1072 -816 Vb_pcasc
FLAG 416 -880 Vdd_bias
FLAG 1184 -880 Vdd
DATAFLAG 960 -208 "round($*10k)/10k"
DATAFLAG 1392 -208 "round($*10k)/10k"
DATAFLAG 1376 -880 "round($*1k)/1k"
DATAFLAG 1248 -400 "round(-Id(x6:x3:M3)*10000000)/10000000"
DATAFLAG 1200 -720 "round($*100)/100"
DATAFLAG 1504 -720 "round($*100)/100"
DATAFLAG 864 -720 "round($*100)/100"
DATAFLAG 560 -816 "round($*100)/100"
DATAFLAG 640 -256 "round($*100)/100"
DATAFLAG 672 -112 "round($*100)/100"
DATAFLAG 864 -512 "round($*100)/100"
DATAFLAG 1536 -496 "round($*100)/100"
DATAFLAG 1280 -592 "round($*100)/100"
DATAFLAG 1088 -400 "round(-Id(x6:x3:M4)*10000000)/10000000"
DATAFLAG 880 -400 "round(Id(x6:x3:M11)*10000000)/10000000"
DATAFLAG 1472 -400 "round(Id(x6:x3:M7)*10000000)/10000000"
DATAFLAG 688 -672 "round($*100)/100"
SYMBOL pmos4 832 -592 M180
SYMATTR InstName M10
SYMATTR Value pch
SYMATTR Value2 l={Lp_casc_GB} w={Wp_casc_GB}
SYMBOL nmos4 832 -336 R0
SYMATTR InstName M11
SYMATTR Value nch
SYMATTR Value2 l={Ln_casc_GB} w={Wn_casc_GB}
SYMBOL nmos4 832 -192 R0
SYMATTR InstName M12
SYMATTR Value nch
SYMATTR Value2 l={Ln_casc_GB} w={Wn_M8_GB}
SYMBOL pmos4 832 -736 M180
SYMATTR InstName M5
SYMATTR Value pch
SYMATTR Value2 l={Lp_casc_GB} w={Wp_casc_GB}
SYMBOL nmos4 480 -192 M0
SYMATTR InstName M13
SYMATTR Value nch
SYMATTR Value2 l={Ln_casc_GB} w={Wn_M8_GB}
SYMBOL current 432 -496 R0
WINDOW 123 0 0 Left 2
WINDOW 39 0 0 Left 2
SYMATTR InstName I1
SYMATTR Value 0.010m
SYMBOL nmos4 480 -336 M0
SYMATTR InstName M14
SYMATTR Value nch
SYMATTR Value2 l={Ln_casc_GB} w={Wn_casc_GB}
SYMBOL current 240 -496 R0
WINDOW 123 0 0 Left 2
WINDOW 39 0 0 Left 2
WINDOW 3 25 75 Left 2
SYMATTR Value 0.05m
SYMATTR InstName I2
SYMBOL nmos4 288 -192 M0
SYMATTR InstName M15
SYMATTR Value nch
SYMATTR Value2 l={Ln_M8_GB} w={Wn_casc_GB}
SYMBOL pmos4 480 -736 R180
SYMATTR InstName M16
SYMATTR Value pch
SYMATTR Value2 l={Lp_casc_GB} w={Wp_casc_GB}
SYMBOL pmos4 480 -592 R180
SYMATTR InstName M17
SYMATTR Value pch
SYMATTR Value2 l={Lp_casc_GB} w={Wp_casc_GB}
SYMBOL pmos4 288 -704 R180
SYMATTR InstName M18
SYMATTR Value pch
SYMATTR Value2 l={Lp_casc_GB} w={Wp_casc_GB}
SYMBOL pmos4 1520 -592 R180
SYMATTR InstName M6
SYMATTR Value pch
SYMATTR Value2 l={Lp_casc_GB} w={Wp_casc_GB}
SYMBOL nmos4 1520 -336 M0
SYMATTR InstName M7
SYMATTR Value nch
SYMATTR Value2 l={Ln_casc_GB} w={Wn_casc_GB}
SYMBOL nmos4 1520 -192 M0
SYMATTR InstName M8
SYMATTR Value nch
SYMATTR Value2 l={Ln_casc_GB} w={Wn_M8_GB}
SYMBOL pmos4 1520 -736 R180
SYMATTR InstName M9
SYMATTR Value pch
SYMATTR Value2 l={Lp_casc_GB} w={Wp_casc_GB}
SYMBOL pmos4 1136 -736 M180
SYMATTR InstName M1
SYMATTR Value pch
SYMATTR Value2 l={Lp_casc_GB} w={Wp_casc_GB}
SYMBOL pmos4 1136 -592 M180
SYMATTR InstName M2
SYMATTR Value pch
SYMATTR Value2 l={Lp_tail} w={Wp_casc_GB}
SYMBOL pmos4 1296 -448 R180
SYMATTR InstName M3
SYMATTR Value pch
SYMATTR Value2 l={L_input_GBP} w={W_input_GBP} m={M_input_GBP}
SYMBOL pmos4 1040 -448 M180
SYMATTR InstName M4
SYMATTR Value pch
SYMATTR Value2 l={L_input_GBP} w={W_input_GBP} m={M_input_GBP}
SYMBOL cap 560 -112 R0
SYMATTR InstName C1
SYMATTR Value 1m
TEXT -200 -1024 Left 2 !.lib 'C:\\Program Files (x86)\\LTC\\LTspiceIV\\lib\\cmp\\log018.l' TT
TEXT -192 -976 Left 2 !.lib opamp.sub
TEXT 1744 -680 Left 2 !.param Wp_casc_GB=5.3u Lp_casc_GB=0.18u Lp_tail=0.36u
TEXT 1744 -640 Left 2 !.param Wn_casc_GB=1u Ln_casc_GB=Lp_casc_GB
TEXT 1744 -600 Left 2 !.param Wn_M8_GB = 2u , Ln_M8_GB=0.18u
TEXT 1752 -552 Left 2 !.param Wn_bias_M15 = Wn_M8_GB/2
TEXT 1752 -512 Left 2 !.param W_input_GBP=9.4u L_input_GBP=0.36u M_input_GBP=2

The netlist it stands for:
* Discrete_Amplifier_1X Test_platform.asc
M1 N004 Vin_p N009 0 nch l={L_input} w={W_input} m={M_input}
M3 N009 Vn_bias_casc N014 0 nch l={Ln_casc} w={Wn_casc} m={Mn_tail}
M4 N014 N008 0 0 nch l={Ln_casc} w={Wn_casc} m={Mn_tail}
M10 Vo_n N006 N004 Vdd pch l={Lp_casc} w={Wp_casc} m={Mp_casc}
M11 Vo_n N010 N012 0 nch l={Ln_casc} w={Wn_casc} m={Mn_casc}
M12 N012 N008 0 0 nch l={Ln_casc} w={Wn_casc} m={Mn_casc}
V1 Vdd 0 1.8
M5 N004 V_cm_fb Vdd Vdd pch l={Lp_casc_top} w={Wp_casc_top} m={Mp_casc_top}
R1 N001 Vo_n 1G noiseless
R2 Vo_p N001 1G noiseless
M13 Vn_bias N008 0 0 nch l={Ln_casc} w={Wn_casc} m={Mn_tail}
I1 N003 N008 {I_bias}
M14 N008 Vn_bias_casc Vn_bias 0 nch l={Ln_casc} w={Wn_casc} m={Mn_tail}
I2 Vp_casc_bias Vn_bias_casc {I_bias_casc}
M15 Vn_bias_casc Vn_bias_casc 0 0 nch l={Ln_casc} w={Wn_casc} m={Mn_tail}
M16 Vp_bias N003 Vdd_bias Vdd pch l={Lp_casc_top} w={Wp_casc_top} m={Mp_casc_top}
M17 N003 Vp_casc_bias Vp_bias Vdd pch l={Lp_casc} w={Wp_casc} m={Mp_casc}
M18 Vp_casc_bias Vp_casc_bias Vdd_bias Vdd pch l={Lp_casc} w={Wp_casc} m={Mp_casc_b}
M2 N005 Vin_n N009 0 nch l={L_input} w={W_input} m={M_input}
M6 Vo_p N007 N005 Vdd pch l={Lp_casc} w={Wp_casc} m={Mp_casc}
M7 Vo_p N011 N013 0 nch l={Ln_casc} w={Wn_Casc} m={Mn_casc}
M8 N013 N008 0 0 nch l={Ln_casc} w={Wn_Casc} m={Mn_casc}
M9 N005 V_cm_fb Vdd Vdd pch l={Lp_casc_top} w={Wp_casc_top} m={Mp_casc_top}
C2 N008 0 1000µ
C1 Vo_n 0 {Cload}
C9 Vo_p 0 {Cload}
C11 Vdd_bias N003 1000µ
XX1 N001 N002 V_cm_fb Vdd Vdd_bias cmfb_amplifier_comp_model
V3 Vdd_bias 0 1.8
V6 N002 0 0.9
XX6 Vp_bias N005 N007 Vdd gb-nmos
XX7 Vp_bias N004 N006 Vdd gb-nmos
XX2 Vn_bias N012 N010 Vdd Vdd_bias gb-pmos
XX3 Vn_bias N013 N011 Vdd Vdd_bias gb-pmos
C12 0 N011 {Cc}
C13 0 N010 {Cc}
C8 0 N006 {Cc}
C10 0 N007 {Cc}

* block symbol definitions
.subckt cmfb_amplifier_comp_model Vcmfb_p Vcmfb_n Vout Vdd_amp Vdd_bias
M1 N001 N001 Vdd_amp Vdd_amp pch l={Lp_CMFB} w={Wp_CMFB} m={Mp_CMFB}
M2 N002 N001 Vdd_amp Vdd_amp pch l={Lp_CMFB} w={Wp_CMFB} m={Mp_CMFB}
M3 N003 Vcmfb_p N005 0 nch l={L_CMFB_in} w={W_CMFB_in} m={M_CMFB_in}
M4 Vout Vcmfb_n N005 0 nch l={L_CMFB_in} w={W_CMFB_in} m={M_CMFB_in}
M5 N005 N004 0 0 nch l={Ln_CMFB_tail} w={Wn_CMFB_tail} m={Mn_CMFB_tail}
I1 Vdd_bias N004 0.1m
M8 N004 N004 0 0 nch l={Ln_CMFB_tail} w={Wn_CMFB_tail} m={Mn_CMFB_tail}
M6 N003 N003 N001 Vdd_amp pch l={Lp_CMFB} w={Wp_CMFB} m={Mp_CMFB}
M7 Vout N003 N002 Vdd_amp pch l={Lp_CMFB} w={Wp_CMFB} m={Mp_CMFB}
.lib 'C:\Program Files (x86)\LTC\LTspiceIV\lib\cmp\log018.l' TT
.lib opamp.sub
.param Wn_CMFB_tail = 20.2u, Ln_CMFB_tail=0.36u*Mn_CMFB_tail, Mn_CMFB_tail=3
.param Wp_CMFB = 66.2u, Lp_CMFB =0.36u*Mp_CMFB , Mp_CMFB = Mn_CMFB_tail
.param W_CMFB_in = 17.9u, L_CMFB_in =0.36u*M_CMFB_in , M_CMFB_in = Mn_CMFB_tail
.ends cmfb_amplifier_comp_model

.subckt gb-nmos Vin_p Vin_n Vout Vdd
M1 N003 Vin_p N007 0 nch l={L_input_GBN} w={W_input_GBN} m={M_input_GBN}
M3 N007 N008 N011 0 nch l={Ln_casc_GB_N} w={Wn_casc_GB_N} m={Mn_tail_GB_N}
M4 N011 Vb_Nmos 0 0 nch l={Ln_casc_GB_N} w={Wn_casc_GB_N} m={Mn_tail_GB_N}
M10 N006 N002 N003 Vdd pch l={Lp_casc_GB_N} w={Wp_casc_GB_N} m={Mp_casc_GB_N}
M11 N006 N008 N010 0 nch l={Ln_casc_GB_N} w={Wn_casc_GB_N} m={Mn_casc_GB_N}
M12 N010 N006 0 0 nch l={Ln_casc_GB_N} w={Wn_casc_GB_N} m={Mn_casc_GB_N}
M5 N003 N001 Vdd Vdd pch l={Lp_casc_top_GB_N} w={Wp_casc_top_GB_N} m={Mp_casc_top_GB_N}
M13 N009 Vb_Nmos 0 0 nch l={Ln_casc_GB_N} w={Wn_casc_GB_N} m={Mn_tail_GB_N}
I1 N001 Vb_Nmos 0.075m
M14 Vb_Nmos N008 N009 0 nch l={Ln_casc_GB_N} w={Wn_casc_GB_N} m={Mn_tail_GB_N}
I2 N002 N008 1.7m
M15 N008 N008 0 0 nch l={Ln_casc_GB_N} w={Wn_casc_GB_N} m={Mn_tail_GB_N}
M16 N005 N001 Vdd Vdd pch l={Lp_casc_top_GB_N} w={Wp_casc_top_GB_N} m={Mp_casc_top_GB_N}
M17 N001 N002 N005 Vdd pch l={Lp_casc_GB_N} w={Wp_casc_GB_N} m={Mp_casc_GB_N}
M18 N002 N002 Vdd Vdd pch l={Lp_casc_GB_N} w={Wp_casc_GB_N} m={Mp_casc_b_GB_N}
M2 N004 Vin_n N007 0 nch l={L_input_GBN} w={W_input_GBN} m={M_input_GBN}
M6 Vout N002 N004 Vdd pch l={Lp_casc_GB_N} w={Wp_casc_GB_N} m={Mp_casc_GB_N}
M7 Vout N008 N012 0 nch l={Ln_casc_GB_N} w={Wn_Casc_GB_N} m={Mn_casc_GB_N}
M8 N012 N006 0 0 nch l={Ln_casc_GB_N} w={Wn_Casc_GB_N} m={Mn_casc_GB_N}
M9 N004 N001 Vdd Vdd pch l={Lp_casc_top_GB_N} w={Wp_casc_top_GB_N} m={Mp_casc_top_GB_N}
C12 N001 Vdd 1000µ
.lib 'C:\Program Files (x86)\LTC\LTspiceIV\lib\cmp\log018.l' TT
.lib opamp.sub
.param Wn_casc_GB_N= 30u, Mn_casc_GB_N=3 , Ln_casc_GB_N=0.18u*Mn_casc_GB_N , Mn_tail_GB_N= Mn_casc_GB_N*2
.param Wp_casc_GB_N=39.7u, Mp_casc_GB_N = Mn_casc_GB_N*2,   Lp_casc_GB_N=0.18u*Mn_casc_GB_N
.param Wp_casc_top_GB_N=79.4u, Mp_casc_top_GB_N = Mn_casc_GB_N, Lp_casc_top_GB_N = 0.18u*Mn_casc_GB_N
* F(x) = 20*log10(abs(V(Vin_p,Vin_n)/1)+1n)
* Top PMOS dimensions (Current SOurce)
* PMOS Cascode Dimensions
* NMOS Cascode Dimensions - with Main M factor
.param Mp_casc_b_GB_N=Mp_casc_GB_N*2
.param W_input_GBN = 22u , L_input_GBN = 0.36u, M_input_GBN =1
.ends gb-nmos

.subckt gb-pmos Vin_p Vin_n Vout Vdd_amp Vdd_bias
M10 N001 N002 N003 N003 pch l={Lp_casc_GB} w={Wp_casc_GB}
M11 N001 N012 N008 N008 nch l={Ln_casc_GB} w={Wn_casc_GB}
M12 N008 N010 0 0 nch l={Ln_casc_GB} w={Wn_M8_GB}
M5 N003 N001 Vdd_amp Vdd_amp pch l={Lp_casc_GB} w={Wp_casc_GB}
M13 N011 N010 0 0 nch l={Ln_casc_GB} w={Wn_M8_GB}
I1 Vb_pcasc N010 0.010m
M14 N010 N012 N011 N011 nch l={Ln_casc_GB} w={Wn_casc_GB}
I2 N002 N012 0.05m
M15 N012 N012 0 0 nch l={Ln_M8_GB} w={Wn_casc_GB}
M16 N006 Vb_pcasc Vdd_bias Vdd_bias pch l={Lp_casc_GB} w={Wp_casc_GB}
M17 Vb_pcasc N002 N006 N006 pch l={Lp_casc_GB} w={Wp_casc_GB}
M18 N002 N002 Vdd_bias Vdd_bias pch l={Lp_casc_GB} w={Wp_casc_GB}
M6 Vout N002 N005 N005 pch l={Lp_casc_GB} w={Wp_casc_GB}
M7 Vout N012 N009 N009 nch l={Ln_casc_GB} w={Wn_casc_GB}
M8 N009 N010 0 0 nch l={Ln_casc_GB} w={Wn_M8_GB}
M9 N005 N001 Vdd_amp Vdd_amp pch l={Lp_casc_GB} w={Wp_casc_GB}
M1 N004 Vb_pcasc Vdd_amp Vdd_amp pch l={Lp_casc_GB} w={Wp_casc_GB}
M2 N007 N002 N004 N004 pch l={Lp_tail} w={Wp_casc_GB}
M3 N009 Vin_n N007 N007 pch l={L_input_GBP} w={W_input_GBP} m={M_input_GBP}
M4 N008 Vin_p N007 N007 pch l={L_input_GBP} w={W_input_GBP} m={M_input_GBP}
C1 N010 0 1m
.lib 'C:\Program Files (x86)\LTC\LTspiceIV\lib\cmp\log018.l' TT
.lib opamp.sub
.param Wp_casc_GB=5.3u Lp_casc_GB=0.18u Lp_tail=0.36u
.param Wn_casc_GB=1u Ln_casc_GB=Lp_casc_GB
.param Wn_M8_GB = 2u , Ln_M8_GB=0.18u
.param Wn_bias_M15 = Wn_M8_GB/2
.param W_input_GBP=9.4u L_input_GBP=0.36u M_input_GBP=2
.ends gb-pmos

.model NMOS NMOS
.model PMOS PMOS
.lib standard.mos
.lib 'C:\Program Files (x86)\LTC\LTspiceIV\lib\cmp\log018.l' TT
.lib opamp.sub
.param Wn_casc= 4.1u Mn_casc=1*N_Mfact Ln_casc=0.50u*Mn_casc  Mn_tail= Mn_casc*2
.param Wp_casc=7.1u Mp_casc = Mn_casc Lp_casc=0.50u*Mn_casc
.param Wp_casc_top=14.1u Mp_casc_top = Mn_casc Lp_casc_top = 0.50u*Mn_casc
.param Vcm=0.90 Cload=0.4p
* F(x) = 20*log10(abs(V(Vin_p,Vin_n)/1)+1n)
* Top PMOS dimensions
* PMOS Cascode Dimensions
* NMOS Cascode Dimensions - with Main M factor
.param Mp_casc_b=Mp_casc*2
* For open loop, short the left side of input capacitance. (Since Ideal Source)
.param W_input = 12u L_input = 0.18u M_input = 4
;noise V(Vo_p,Vo_n) V2 dec 100 100 100G
* Current Control
.param I_bias=0.020m * N_Mfact I_bias_casc=0.2m*N_Mfact
* .step param Cc 0 1p 0.1p
.param Cc 100f
.backanno
.end